# Altium project Node_Sensor_Lora.PrjPCB
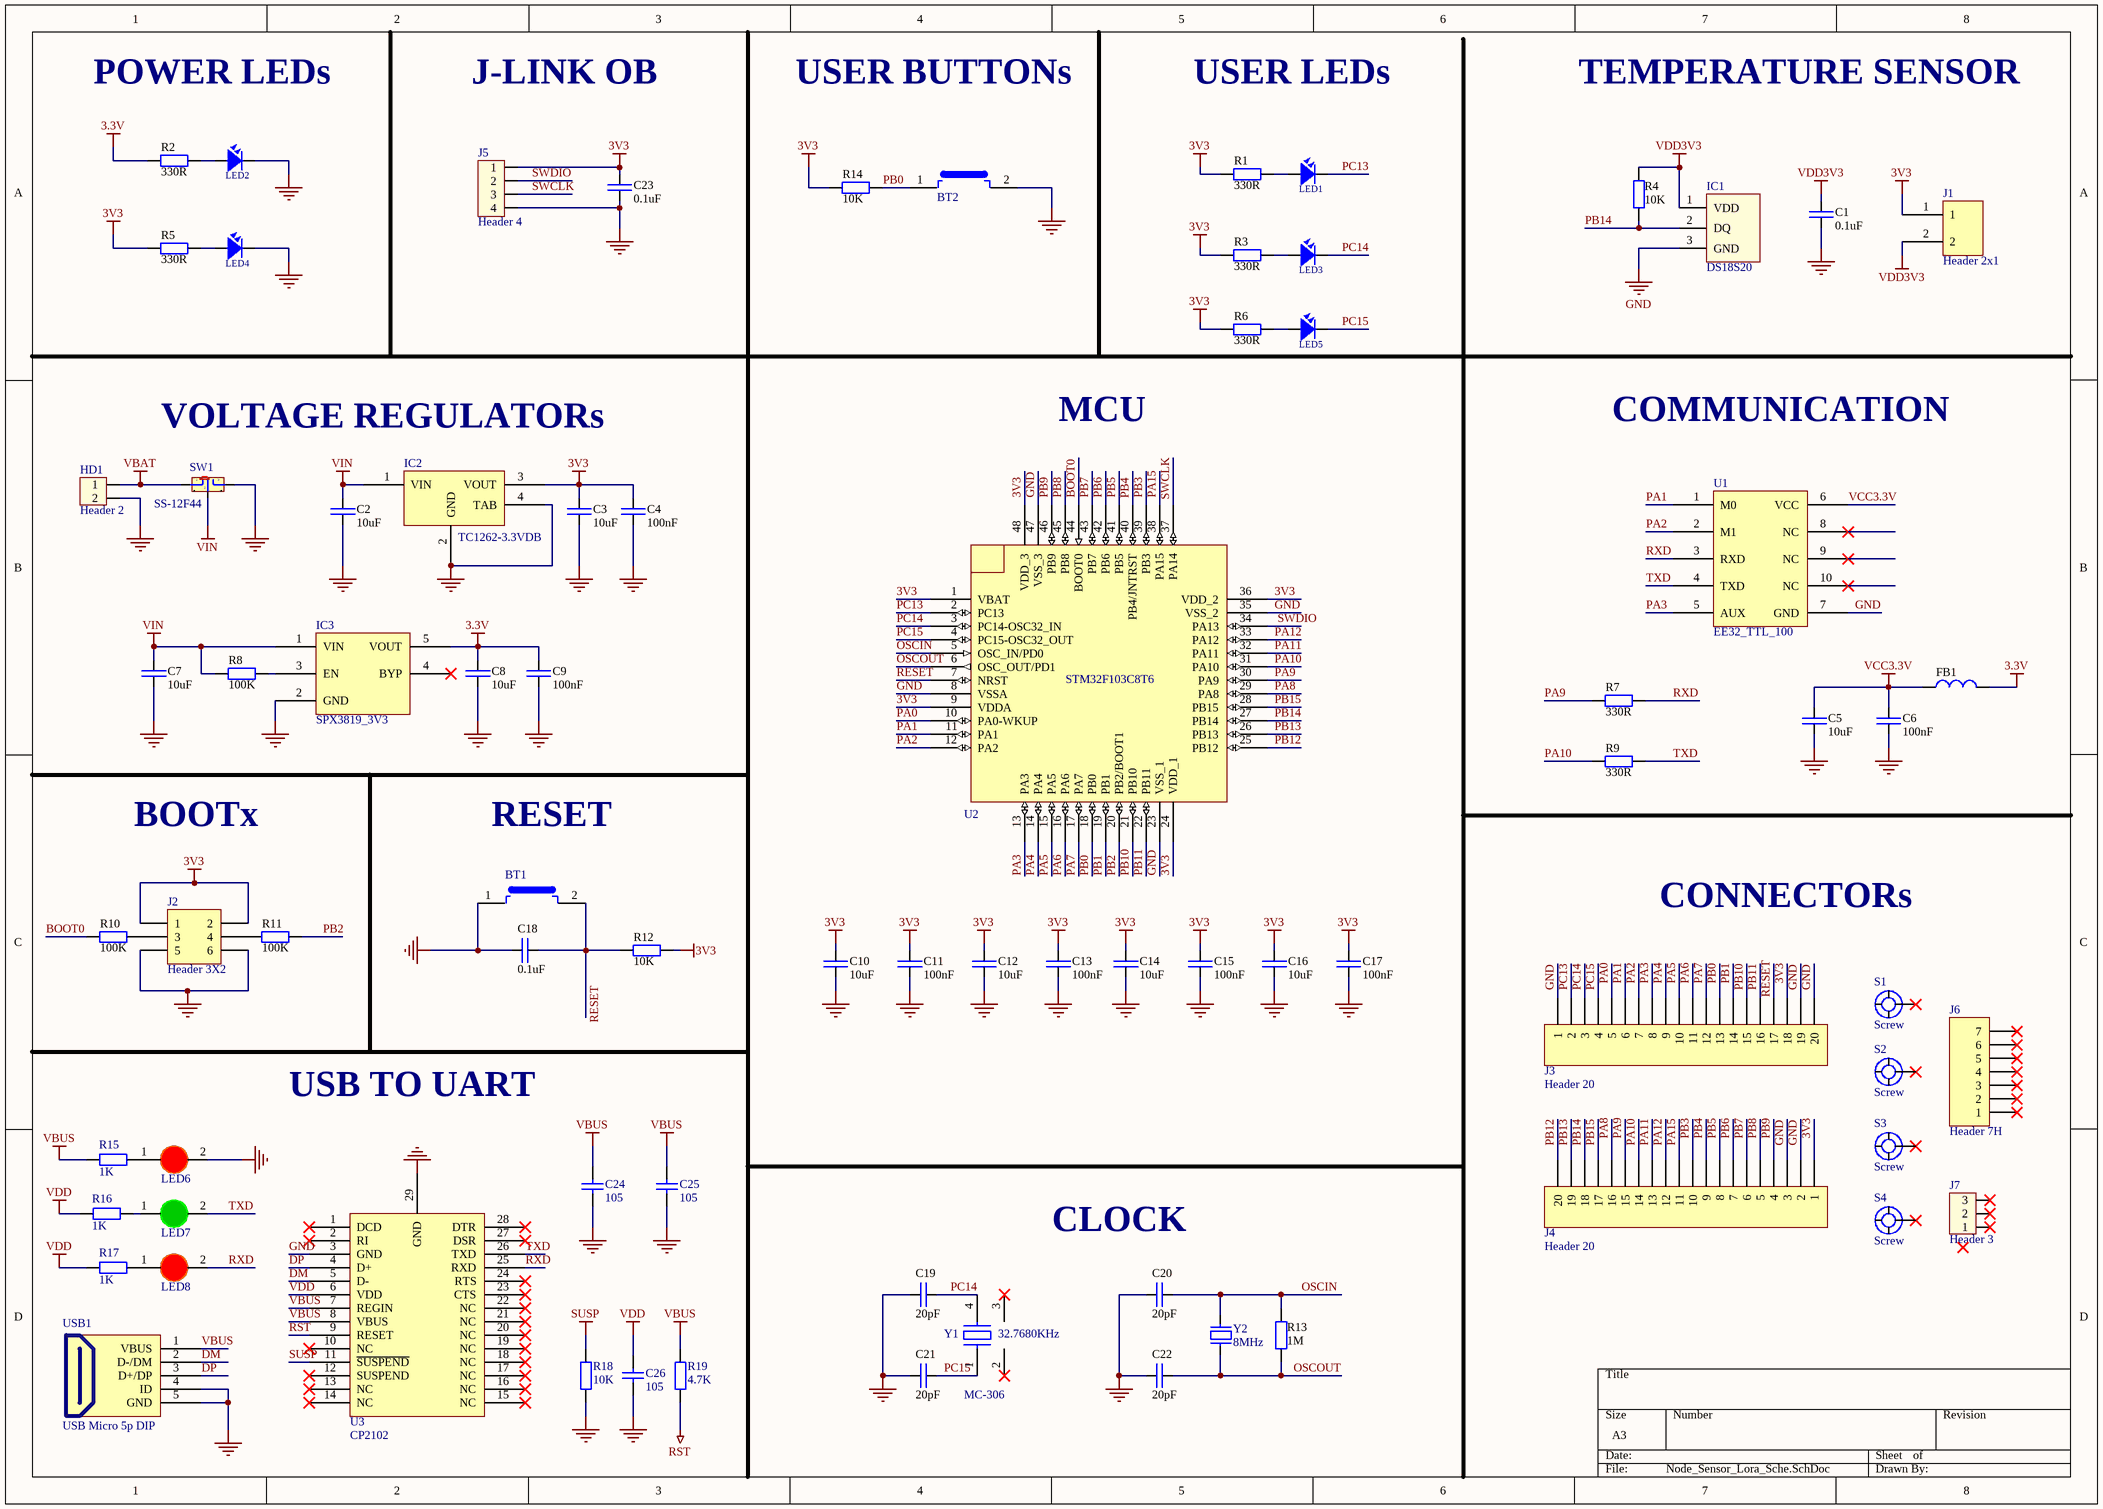
[diagram p0: Node_Sensor_Lora_Sche.SchDoc]
1 sheet, 78 parts. Net scope: global (net labels, ports and power ports of the same name join across sheets).
Board file: Node_Sensor_Lora_PCB.PcbDoc

## Sheet Node_Sensor_Lora_Sche.SchDoc
size A3

### Parts
BT1  (no value)  [SW4]
BT2  BT  [SW4]  (value not drawn)
C1  value 0.1uF  [CAPC2012X135N]  (hidden comment: approved sub OK)
C2  value 10uF  [CAPC2012X135N]  (hidden comment: approved sub OK)
C3  value 10uF  [CAPC2012X135N]  (hidden comment: approved sub OK)
C4  value 100nF  [CAPC2012X135N]  (hidden comment: approved sub OK)
C5  value 10uF  [CAPC2012X135N]  (hidden comment: approved sub OK)
C6  value 100nF  [CAPC2012X135N]  (hidden comment: approved sub OK)
C7  value 10uF  [CAPC2012X135N]  (hidden comment: approved sub OK)
C8  value 10uF  [CAPC2012X135N]  (hidden comment: approved sub OK)
C9  value 100nF  [CAPC2012X135N]  (hidden comment: approved sub OK)
C10  value 10uF  [CAPC2012X135N]  (hidden comment: approved sub OK)
C11  value 100nF  [CAPC2012X135N]  (hidden comment: approved sub OK)
C12  value 10uF  [CAPC2012X135N]  (hidden comment: approved sub OK)
C13  value 100nF  [CAPC2012X135N]  (hidden comment: approved sub OK)
C14  value 10uF  [CAPC2012X135N]  (hidden comment: approved sub OK)
C15  value 100nF  [CAPC2012X135N]  (hidden comment: approved sub OK)
C16  value 10uF  [CAPC2012X135N]  (hidden comment: approved sub OK)
C17  value 100nF  [CAPC2012X135N]  (hidden comment: approved sub OK)
C18  value 0.1uF  [CAPC2012X135N]  (hidden comment: approved sub OK)
C19  value 20pF  [CAPC2012X135N]  (hidden comment: approved sub OK)
C20  value 20pF  [CAPC2012X135N]  (hidden comment: approved sub OK)
C21  value 20pF  [CAPC2012X135N]  (hidden comment: approved sub OK)
C22  value 20pF  [CAPC2012X135N]  (hidden comment: approved sub OK)
C23  value 0.1uF  [CAPC2012X135N]  (hidden comment: approved sub OK)
C24  105  [tu 0805]
C25  105  [tu 0805]
C26  105  [tu 0805]
FB1  2K2 @ 100 MHz  [FBC2012N]  (value not drawn)
HD1  Header 2  [HED2]
IC1  DS18S20  [DS18S20]
IC2  TC1262-3.3VDB  [SOT223]
IC3  SPX3819_3V3  [SOT23-5]
J1  Header 2x1  [HDR_2x1]
J2  Header 3X2  [HDR2X3]
J3  Header 20  [HDR1X20]
J4  Header 20  [HDR1X20]
J5  Header 4  [HDR _4PINS]
J6  Header 7H  [CON7]
J7  Header 3  [HED3]
LED1  LED SMD  [SM-LED-0805-Blue]  (value not drawn)
LED2  LED SMD  [SM-LED-0805-Blue]  (value not drawn)
LED3  LED SMD  [SM-LED-0805-Blue]  (value not drawn)
LED4  LED SMD  [SM-LED-0805-Blue]  (value not drawn)
LED5  LED SMD  [SM-LED-0805-Blue]  (value not drawn)
LED6  LED 0805  [LED-0805-Red]  (value not drawn)
LED7  LED 0805  [LED-0805-Green]  (value not drawn)
LED8  LED 0805  [LED-0805-Red]  (value not drawn)
R1  value 330R  [RESC2012N_ZERO]  (hidden comment: 100R)
R2  330R  [RESC2012N_ZERO]
R3  value 330R  [RESC2012N_ZERO]  (hidden comment: 100R)
R4  value 10K  [RESC2012N_ZERO]  (hidden comment: 100R)
R5  value 330R  [RESC2012N_ZERO]  (hidden comment: 100R)
R6  value 330R  [RESC2012N_ZERO]  (hidden comment: 100R)
R7  value 330R  [RESC2012N_ZERO]  (hidden comment: 100R)
R8  value 100K  [RESC2012N_ZERO]  (hidden comment: 100R)
R9  value 330R  [RESC2012N_ZERO]  (hidden comment: 100R)
R10  value 100K  [RESC2012N_ZERO]  (hidden comment: 100R)
R11  value 100K  [RESC2012N_ZERO]  (hidden comment: 100R)
R12  value 10K  [RESC2012N_ZERO]  (hidden comment: 100R)
R13  value 1M  [RESC2012N_ZERO]  (hidden comment: 100R)
R14  value 10K  [RESC2012N_ZERO]  (hidden comment: 100R)
R15  1K  [tro smd 0805]
R16  1K  [tro smd 0805]
R17  1K  [tro smd 0805]
R18  10K  [tro smd 0805]
R19  4.7K  [tro smd 0805]
S1  Screw  [Screw 3 small]
S2  Screw  [Screw 3 small]
S3  Screw  [Screw 3 small]
S4  Screw  [Screw 3 small]
SW1  SS-12F44  [SW102]
U1  EE32_TTL_100  [E32_TTL_100]
U2  STM32F103C8T6  [STM32_LQPF48]
U3  CP2102  [CP2102]
USB1  USB Micro 5p DIP  [USB Micro 5p DIP]
Y1  32.7680KHz  Part Number: MC-306  [Epson_MC-306_32.7680K-A0-ROHS_0]
Y2  8MHz  [CRYSTAL]

### Nets
3.3V: C8.1 C9.1 FB1.2 IC3.5(VOUT) R2.1
3V3: C3.1 C4.1 C10.1 C11.1 C12.1 C13.1 C14.1 C15.1 C16.1 C17.1 C23.1 IC2.3(VOUT) J1.1 J2.1 J2.2 J3.18 J4.1 J5.1 R1.1 R3.1 R5.1 R6.1 R12.1 R14.1 U2.1(VBAT) U2.9(VDDA) U2.24(VDD_1) U2.36(VDD_2) U2.48(VDD_3)
GND: BT1.1 BT2.2 C1.1 C2.2 C3.2 C4.2 C5.2 C6.2 C7.2 C8.2 C9.2 C10.2 C11.2 C12.2 C13.2 C14.2 C15.2 C16.2 C17.2 C18.2 C19.1 C20.1 C21.1 C22.1 C23.2 C24.2 C25.2 C26.2 HD1.2 IC1.3(GND) IC2.2(GND) IC2.4(TAB) IC3.2(GND) J2.5 J2.6 J3.1 J3.19 J3.20 J4.2 J4.3 J5.4 LED2.2 LED4.2 LED6.2(K) R18.1 SW1.3 U1.7(GND) U2.8(VSSA) U2.23(VSS_1) U2.35(VSS_2) U2.47(VSS_3) U3.3(GND) U3.29(GND) USB1.4(ID) USB1.5(GND)
RST: R19.1 U3.9(RESET)
SUSP: R18.2 U3.11(~{SUSPEND})
VBAT: HD1.1 SW1.1
VBUS: C24.1 C25.1 R15.2 R19.2 U3.7(REGIN) U3.8(VBUS) USB1.1(VBUS)
VCC3.3V: C5.1 C6.1 FB1.1 U1.6(VCC)
VDD: C26.1 R16.2 R17.2 U3.6(VDD)
VDD3V3: C1.2 IC1.1(VDD) J1.2 R4.2
VIN: C2.1 C7.1 IC2.1(VIN) IC3.1(VIN) R8.1 SW1.2
BOOT0: R10.1 U2.44(BOOT0)
DM: U3.5(D-) USB1.2(D-/DM)
DP: U3.4(D+) USB1.3(D+/DP)
OSCIN: C20.2 R13.1 U2.5(OSC_IN/PD0) Y2.2
OSCOUT: C22.2 R13.2 U2.6(OSC_OUT/PD1) Y2.1
PA0: J3.5 U2.10(PA0-WKUP)
PA1: J3.6 U1.1(M0) U2.11(PA1)
PA2: J3.7 U1.2(M1) U2.12(PA2)
PA3: J3.8 U1.5(AUX) U2.13(PA3)
PA4: J3.9 U2.14(PA4)
PA5: J3.10 U2.15(PA5)
PA6: J3.11 U2.16(PA6)
PA7: J3.12 U2.17(PA7)
PA8: J4.16 U2.29(PA8)
PA9: J4.15 R7.1 U2.30(PA9)
PA10: J4.14 R9.1 U2.31(PA10)
PA11: J4.13 U2.32(PA11)
PA12: J4.12 U2.33(PA12)
PA15: J4.11 U2.38(PA15)
PB0: BT2.1 J3.13 R14.2 U2.18(PB0)
PB1: J3.14 U2.19(PB1)
PB2: R11.2 U2.20(PB2/BOOT1)
PB3: J4.10 U2.39(PB3)
PB4: J4.9 U2.40(PB4/JNTRST)
PB5: J4.8 U2.41(PB5)
PB6: J4.7 U2.42(PB6)
PB7: J4.6 U2.43(PB7)
PB8: J4.5 U2.45(PB8)
PB9: J4.4 U2.46(PB9)
PB10: J3.15 U2.21(PB10)
PB11: J3.16 U2.22(PB11)
PB12: J4.20 U2.25(PB12)
PB13: J4.19 U2.26(PB13)
PB14: IC1.2(DQ) J4.18 R4.1 U2.27(PB14)
PB15: J4.17 U2.28(PB15)
PC13: J3.2 LED1.2 U2.2(PC13)
PC14: C19.2 J3.3 LED3.2 U2.3(PC14-OSC32_IN) Y1.4
PC15: C21.2 J3.4 LED5.2 U2.4(PC15-OSC32_OUT) Y1.1
RESET: BT1.2 C18.1 J3.17 R12.2 U2.7(NRST)
RXD: LED8.2(K) R7.2 U1.3(RXD) U3.25(RXD)
SWCLK: J5.3 U2.37(PA14)
SWDIO: J5.2 U2.34(PA13)
TXD: LED7.2(K) R9.2 U1.4(TXD) U3.26(TXD)
NetIC3_3: IC3.3(EN) R8.2
NetJ2_3: J2.3 R10.2
NetJ2_4: J2.4 R11.1
NetLED1_1: LED1.1 R1.2
NetLED2_1: LED2.1 R2.2
NetLED3_1: LED3.1 R3.2
NetLED4_1: LED4.1 R5.2
NetLED5_1: LED5.1 R6.2
NetLED6_1: LED6.1(A) R15.1
NetLED7_1: LED7.1(A) R16.1
NetLED8_1: LED8.1(A) R17.1

Not connected (* = marked no-connect by the designer): IC3 4(BYP)*; J6 1* 2* 3* 4* 5* 6* 7*; J7 1* 2* 3*; S1 1*; S2 1*; S3 1*; S4 1*; SW1 4 5; U1 8(NC)* 9(NC)* 10(NC)*; U3 1(DCD)* 2(RI)* 10(NC)* 12(SUSPEND)* 13(NC)* 14(NC)* 15(NC)* 16(NC)* 17(NC)* 18(NC)* 19(NC)* 20(NC)* 21(NC)* 22(NC)* 23(CTS)* 24(RTS)* 27(DSR)* 28(DTR)*; Y1 2(NC)* 3(NC)*

### Notes on the sheet
- POWER LEDs
- J-LINK OB
- USER BUTTONs
- USER LEDs
- TEMPERATURE SENSOR
- VOLTAGE REGULATORs
- MCU
- COMMUNICATION
- BOOTx
- RESET
- CONNECTORs
- USB TO UART
- CLOCK

### Library data of the parts
BT1 BT2 = BUTTON
C1-C23 = CAP C_0805: Capacitor SMD Cer 1.8nF 10% 50V X7R 0805; Manufacturer 1: AVX Corporation; Manufacturer Part Number 1: 08055C182KAT2A; Ratings: 50V; X7R; SCDType: source*; Tolerance: ±10%; Operating Temperature: -55°C ~ 125°C; Package / Case: 0805 (2012 metric); Supplier 1: Digi-Key; Supplier Part Number 1: 478-1374-1-ND
C24-C26 = Tu 0805 105 50V 10%: Dán; Don_Vi: Con; So_Chan: 2; Ten_Linh_Kien: Tụ 0805 105-1uF 10% 50V; Ma_Hang: MH004552; Chung_Loai: Dán; Kieu_Chan: *
FB1 = FERRITE_2K2-100MHz_0805: Ferrite bead 2.2K Ohm at 100 MHz 200mA 0805 SMD; Manufacturer 1: Laird-Signal Integrity Products; Manufacturer Part Number 1: HZ0805B222R-10; Ratings: 200 mA; 800 mOhm DC; Impedance @ Frequency: 600 Ohm @ 100MHz; DC Resistance (DCR): 800 mOhm Max; Filter Type: Differential Mode - Single; SCDType: source; Size / Dimension: 0.063" L x 0.031" W (1.60mm x 0.80mm); Current Rating: 200mA; Package / Case: 0805 (2012 Metric); Height (Max): 0.043" (1.09mm); ComponentLink1URL: http://www.lairdtech.com/WorkArea/linkit.aspx?LinkIdentifier=id&ItemID=4879; ComponentLink1Description: http://www.lairdtech.com/WorkArea/linkit.aspx?LinkIdentifier=id&ItemID=4879; Supplier 1: Digi-Key; Supplier Part Number 1: 240-2562-1-ND; Mounting Type: Surface Mount; Value: 2K2 @ 100 MHz
HD1 = Header 2: Header 2 (Green); Value: Header 2
IC1 = DS18S20: High Precision  1-Wire® Digital Thermometer
IC2 = AMS1117: SOT223, Fixed Voltage
IC3 = SPX3819
J1 = Header_2pins
J2 = Header 3X2: Header, 3-Pin, Dual row; LatestRevisionDate: 17-Jul-2002; LatestRevisionNote: Re-released for DXP Platform.; Publisher: Altium Limited
J3 J4 = Header 20: Header, 20-Pin; LatestRevisionDate: 17-Jul-2002; LatestRevisionNote: Re-released for DXP Platform.; Publisher: Altium Limited
J5 = Header 4: Header 4 (Green); Value: Header 4
J6 = Header 7H: Header, 7-Pin, Right Angle; LatestRevisionDate: 17-Jul-2002; LatestRevisionNote: Re-released for DXP Platform.; Publisher: Altium Limited
J7 = Header 3: Header 3 (Green); Value: Header 3
LED1-LED5 = LED SMD 0805
LED6 LED8 = LED 0805 Do: Dán; Don_Vi: Con; Ma_Hang: MH000897; Ten_Linh_Kien: LED 0805 Màu Đỏ (Red); Ghi_Chu: *; Kieu_Chan: *; Chung_Loai: Dán
LED7 = LED 0805 Xanh La: Dán; Don_Vi: Con; Ma_Hang: MH002326; Ten_Linh_Kien: LED 0805 Màu Xanh Lá (Green); Ghi_Chu: *; Kieu_Chan: *; Chung_Loai: Dán
R1-R14 = RES_0805: Resistor SMD chip 0.0 Ohm 0.125W 0805; Manufacturer 1: Samsung Electro-Mechanics America, Inc; Manufacturer Part Number 1: RC2012J000CS; Ratings: 1/8W; SCDType: spec; Tolerance: N/A; Package / Case: 0805 (2012 metric); Supplier 1: Digi-Key; Supplier Part Number 1: 1276-5466-6-ND; RoHS 1: RoHS Compliant; Supplier 2: Digi-Key; Supplier Part Number 2: RMCF0805ZT0R00DKR-ND; Manufacturer 2: Stackpole Electronics Inc; Manufacturer Part Number 2: RMCF0805ZT0R00; RoHS 2: RoHS Compliant; Supplier 3: Digi-Key; Supplier Part Number 3: 311-0.0ARDKR-ND; Manufacturer 3: Yageo; Manufacturer Part Number 3: RC0805JR-070RL; RoHS 3: RoHS Compliant; Supplier 4: Digi-Key; Supplier Part Number 4: P0.0ADKR-ND; Manufacturer 4: Panasonic Electronic Components; Manufacturer Part Number 4: ERJ-6GEY0R00V; RoHS 4: RoHS Compliant; Supplier 5: Digi-Key; Supplier Part Number 5: RHM0.0CPDKR-ND; Manufacturer 5: Rohm Semiconductor; Manufacturer Part Number 5: MCR10ERTJ000; RoHS 5: RoHS Compliant
  R2: Value: 330R
R15-R19 = Tro 0805 1% 10k: Dán; Don_Vi: Con; So_Chan: 2; Ten_Linh_Kien: Trở 0805 1% 10k; Ma_Hang: MH005473; Chung_Loai: Dán; Kieu_Chan: *
SW1 = SW102A: Switch 102 on Broad; Value: Switch 102 On Board
U1 = Module Lora E32_TTL_100
U2 = STM32F103xx_LQFP48: STM32 ARM-based 32-bit MCU with 64 Kbytes Flash, 48-pin LQFP, Industrial Temperature; Published: 30-May-2008; DatasheetVersion: rev6, Mar-2008; PackageVersion: Mar-2008; PackageReference: LQFP48; Publisher: Altium Limited; PackageDescription: 48-Pin Low-Profile Quad Flat Pack, 7 x 7 mm Body, 0.5 mm Pitch (LQFP48); ComponentLink1Description: Manufacturer Link; ComponentLink1URL: www.st.com/stm32; ComponentLink2Description: Datasheet; ComponentLink2URL: http://www.st.com/stonline/products/literature/ds/13587.pdf
USB1 = USB Micro 5p DIP: USB Type B; Ten: MicroUSB MK5P DIP; Ma_Hang: MH005145
Y1 = Crys_Epson_MC-306_32.7680K-A0-ROHS_eec: CRYSTAL 32.7680KHZ 12.5PF SMD; Manufacturer: Epson; helpURL: https://upverter.com/upn/revision/56373362b6f292da/; ComponentLink2Description: Datasheet; Temperature: -40°C to +85°C; Package: SMT_XTAL_8MM0_3MM20; Supplier 2: Mouser; Price: 0.391082880903; Supplier 1: Digi-Key; ComponentLink1URL: https://upverter.com/upn/revision/56373362b6f292da/; Supplier Part Number 2: 732-MC30632.7680KA0R; Supplier Part Number 1: SER2407CT-ND; ComponentLink1Description: Upverter; ComponentLink2URL: http://media.digikey.com/pdf/Data%20Sheets/Epson%20PDFs/MC-306%20,405,%20406.pdf; RoHS: TRUE; Mouser Part Number: 732-MC30632.7680KA0R; Digikey Description: CRYSTAL 32.7680KHZ 12.5PF SMD; Digikey Part Number: SER2407CT-ND; Lead Free: yes; Temperature Range Low: -40°C; Temperature Range High: +85°C
Y2 = CRYSTAL: Crystal For all Crystal 2pin.; Value: 4Mhz